# EAGLE design Encoder (EAGLE 9.3.0)
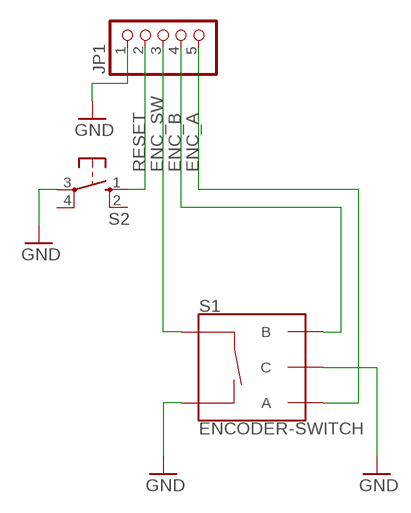
[diagram p0: schematic, sheet 1]

## Parts
JP1  PINHD-1X5/90  [1X05/90]
S1  ENCODER-SWITCH  [ROTARY_ENC_PLAIN]
S2  10-XX  [B3F-10XX]

## Nets
ENC_A: JP1.5 S1.A
ENC_B: JP1.4 S1.B
ENC_SW: JP1.3 S1.SW+
GND: JP1.1 S1.C S1.SW- S2.3(P)
RESET: JP1.2 S2.1(S)
Unconnected: S2.2(S1) S2.4(P1)

## Library data of the parts
JP1 = pinhead:PINHD-1X5: PIN HEADER
S1 = SparkFun-Switches:ENCODER-SWITCH: Rotary Encoder w/ Select Switch Encoders rotate similarly to potentiometers, but they’re different from potentiometers in that an encoder has full rotation without limits. They output gray code so that you can tell how much and in which direction the encoder has been turned. This encoder includes a push-down select switch built into the shaft. SparkFun Products Rotary Encoder <https://www.sparkfun.com/products/9117> (COM-09117); SF_SKU: COM-09117
S2 = switch-omron:10-XX: OMRON SWITCH; MPN: B3F-1000; OC_FARNELL: 176432; OC_NEWARK: 36M3542

## Board
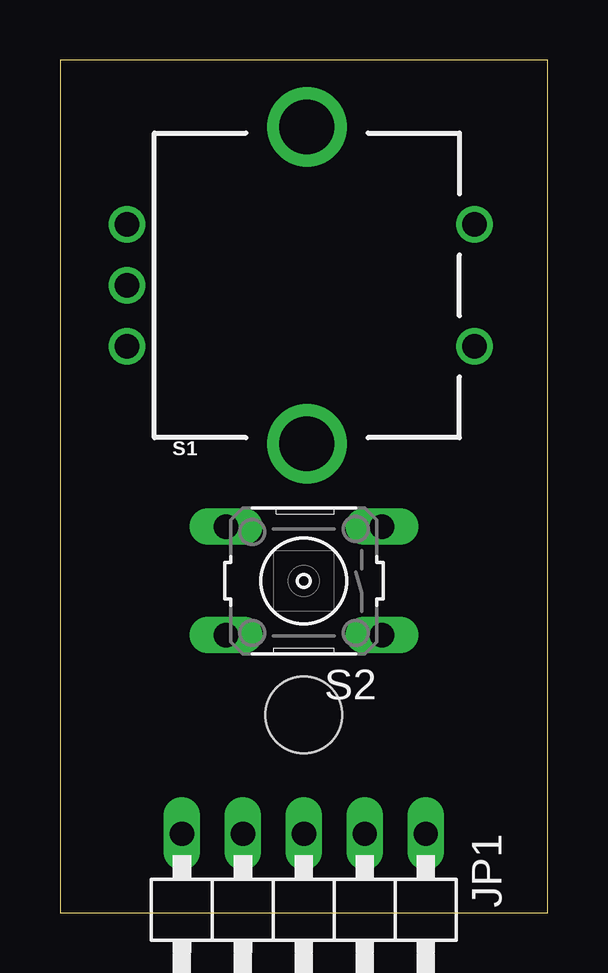
[diagram p1: board, top side]
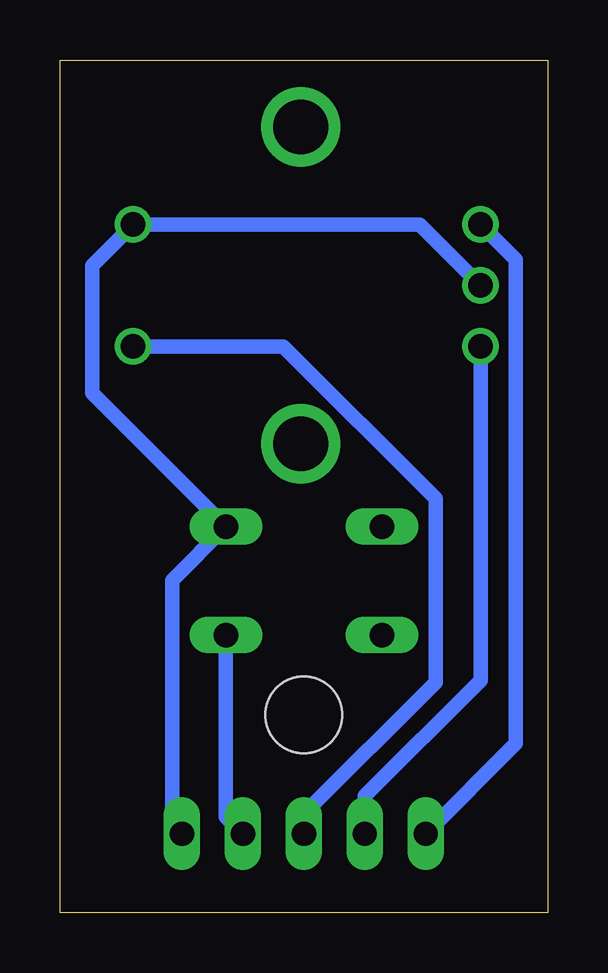
[diagram p2: board, bottom side, seen from below]

Size 20.32 x 35.56 mm. Coordinates in mm from the lower left corner, seen from the top.
Outline: 0,0 20.32,0 20.32,35.56 0,35.56 0,0
Copper layers (1*16): Top 0.035mm / dielectric 1.5mm / Bottom 0.035mm
Design rules "default *": minimum track width 6mil, minimum drill 0.35mm, track to track 16mil, track to pad 16mil, pad to pad 16mil, via to via 16mil, smd to smd 10mil, copper to edge 40mil, drill to drill 6mil, minimum pad ring 10mil, minimum via ring 8mil, stop-mask expansion 4mil, vias tented up to drill 0mil, thermal gap 10mil
Holes 3.2 mm at 10.16,8.26

### Footprints (pad centres in the part's own frame; a part is rotated, then mirrored left to right if it is on the bottom)
1X05/90 = drill 1.016 long: 1 -5.08,-3.81; 2 -2.54,-3.81; 3 0,-3.81; 4 2.54,-3.81; 5 5.08,-3.81
ROTARY_ENC_PLAIN = drill 1.016: A 7.493,-2.54; B 7.493,2.54; C 7.493,0; SW+ -6.985,2.54; SW- -6.985,-2.54 | drill 2.286: P$3 0,6.604; P$4 0,-6.604
B3F-10XX = drill 1.016 long: 1 -3.251,2.261; 2 3.251,2.261; 3 -3.251,-2.261; 4 3.251,-2.261

### Placement (x,y rotation side)
JP1  10.16,-0.51 180 top
S1  10.29,26.16 180 top
S2  10.16,13.84 180 top

### Tracks (layer width: path | path; a pad name or v marks a point on that pad's centre or on a via)
ENC_A
  Bottom 0.61: S1.A 1.32,27.23 1.32,7.06 JP1.5
ENC_B
  Bottom 0.61: S1.B 2.79,9.7 7.62,4.88 JP1.4
ENC_SW
  Bottom 0.61: JP1.3 10.16,4.12 4.67,9.61 4.67,17.29 11.01,23.62 S1.SW+
GND
  Bottom 0.61: S1.C 5.33,28.7 S1.SW- 18.98,27 18.98,21.67 S2.3 15.65,13.87 15.65,3.71 JP1.1
RESET
  Bottom 0.61: S2.1 13.41,4.01 JP1.2